# Altium schematic sheet adc_power.SchDoc
size A4; Author: Omri Nissan; Organization: Altium Limited; Address1: -; Address2: San Luis Obispo; Address3: California, 93401; Address4: United States; DocumentNumber: 10; SheetNumber: 10; SheetTotal: 10
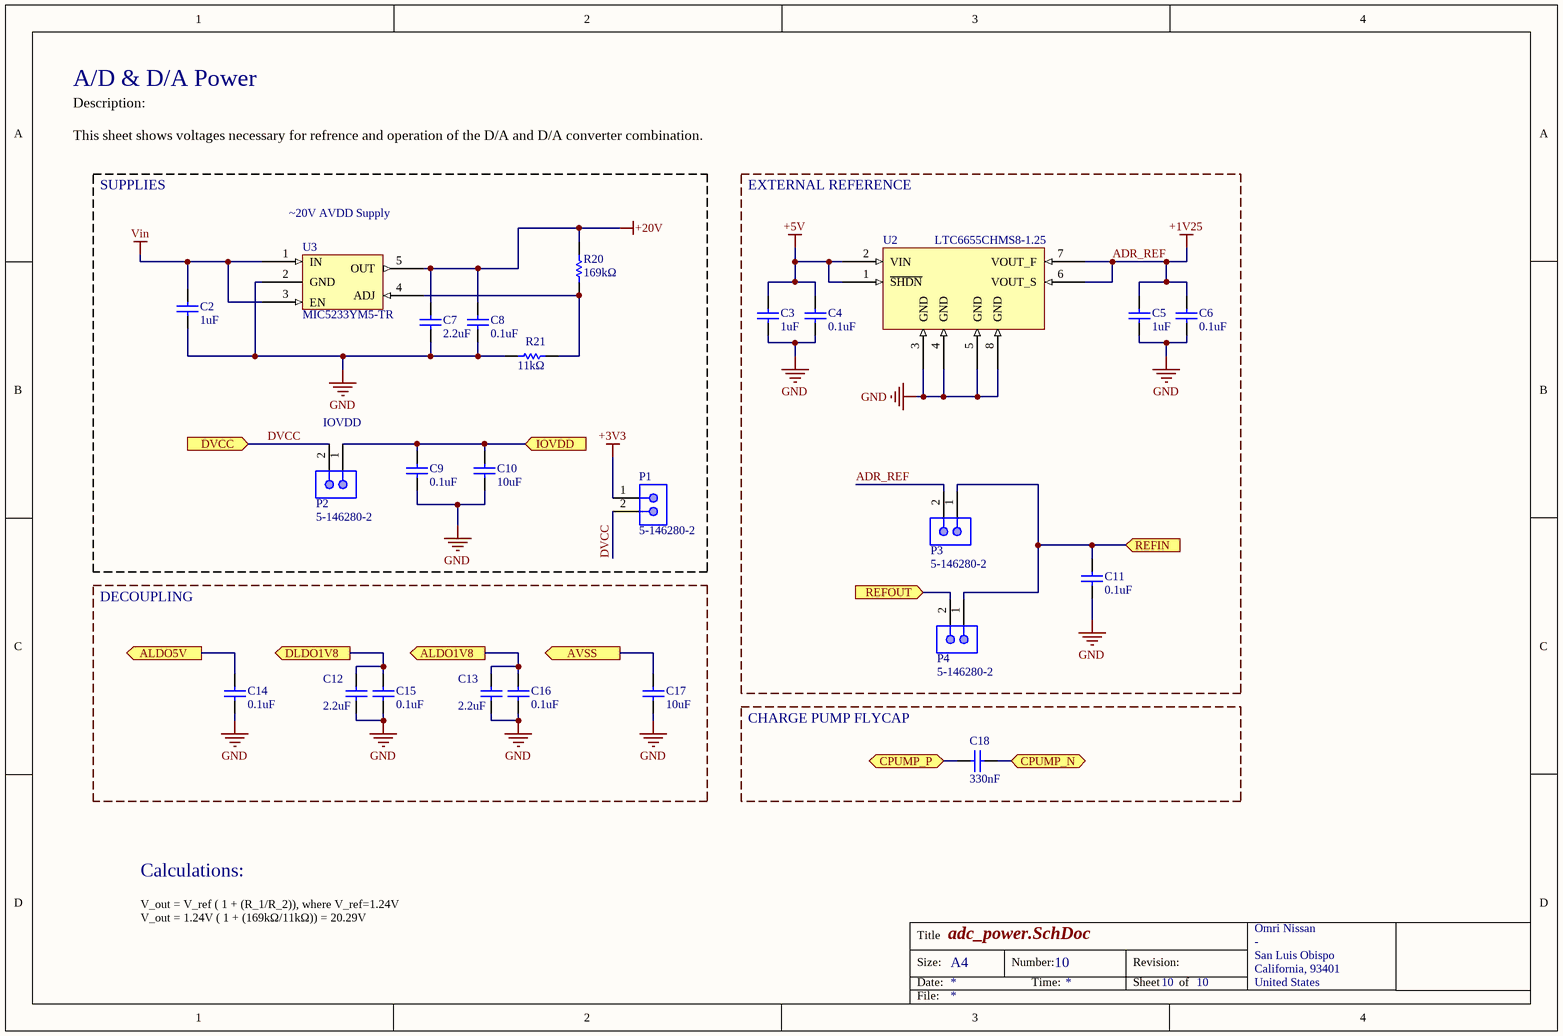
[diagram p0: adc_power.SchDoc]

## Parts
C2  1uF  [CAPC1608X90X20LL10]
C3  1uF  [CAPC1608X90X20LL10]
C4  0.1uF  [CAPC1608X90X35ML10T15]
C5  1uF  [CAPC1608X90X20LL10]
C6  0.1uF  [CAPC1608X90X35ML10T15]
C7  2.2uF  [CAPC2013X145X20LL20]
C8  0.1uF  [CAPC1608X90X35ML10T15]
C9  0.1uF  [CAPC1608X90X35ML10T15]
C10  10uF  [CAPC3216X180X20LL20]
C11  0.1uF  [CAPC1608X90X35ML10T15]
C12  2.2uF  [CAPC2013X145X20LL20]
C13  2.2uF  [CAPC2013X145X20LL20]
C14  0.1uF  [CAPC1608X90X35ML10T15]
C15  0.1uF  [CAPC1608X90X35ML10T15]
C16  0.1uF  [CAPC1608X90X35ML10T15]
C17  10uF  [CAPC3216X180X20LL20]
C18  330nF  [CAPC1608X90X35NL10T15]
P1  5-146280-2  [TECO-5-146280-2_V]
P2  5-146280-2  [TECO-5-146280-2_V]
P3  5-146280-2  [TECO-5-146280-2_V]
P4  5-146280-2  [TECO-5-146280-2_V]
R20  169kΩ  [RESC1608X55X30ML15T15]
R21  11kΩ  [RESC1609X50X30ML10T20]
U2  LTC6655CHMS8-1.25  [ADI-RM-8_L]
U3  MIC5233YM5-TR  [MF05A_L]

## Blocks framed on the sheet
SUPPLIES: C2 C7-C10 P1 P2 R20 R21 U3
EXTERNAL REFERENCE: C3-C6 C11 P3 P4 U2
DECOUPLING: C12-C17
CHARGE PUMP FLYCAP: C18

## Ports
ALDO1V8 (out), ALDO5V (out), AVSS (out), CPUMP_N (bidir), CPUMP_P (bidir), DLDO1V8 (out), DVCC (in), IOVDD (in), REFIN (in), REFOUT (in)

## Nets
+3V3: P1.1
+5V: C3.1 C4.2 U2.1(~{SHDN}) U2.2(VIN)
+20V: C7.2 C8.2 R20.2 U3.5(OUT)
ADR_REF: C5.1 C6.2 P3.2 U2.6(VOUT_S) U2.7(VOUT_F)  [also labelled +1V25]
GND: C2.2 C3.2 C4.1 C5.2 C6.1 C7.1 C8.1 C9.1 C10.1 C11.1 C12.1 C13.1 C14.1 C15.1 C16.1 C17.1 R21.1 U2.3(GND) U2.4(GND) U2.5(GND) U2.8(GND) U3.2(GND)
Vin: C2.1 U3.1(IN) U3.3(EN)
ALDO1V8: C13.2 C16.2 ; port ALDO1V8
ALDO5V: C14.2 ; port ALDO5V
AVSS: C17.2 ; port AVSS
CPUMP_N: C18.2 ; port CPUMP_N
CPUMP_P: C18.1 ; port CPUMP_P
DLDO1V8: C12.2 C15.2 ; port DLDO1V8
DVCC: P1.2 P2.2 ; port DVCC
IOVDD: C9.2 C10.2 P2.1 ; port IOVDD
REFIN: C11.2 P3.1 P4.1 ; port REFIN
REFOUT: P4.2 ; port REFOUT
NetR20_1: R20.1 R21.2 U3.4(ADJ)

## Notes on the sheet
- A/D & D/A Power
- Description:
  This sheet shows voltages necessary for refrence and operation of the D/A and D/A converter combination.
- (near U3) ~20V AVDD Supply
- (near P2) IOVDD
- Calculations:
- V_out = V_ref ( 1 + (R_1/R_2)), where V_ref=1.24V
  V_out = 1.24V ( 1 + (169kΩ/11kΩ)) = 20.29V
- Title
- Size:
- Date:
- A4
- Number:
- Time:
- Revision:
- Sheet
- of
- File:

## Library data of the parts
C2 C3 C5 = CMP-2000-06025-1: C1608X5R1H105K080AB- Chip Capacitor, 1 uF, +/- 10%, 50 V, -55 to 85 degC, 0603 (1608 Metric), RoHS, Tape and Reel; Manufacturer: TDK; PCN Part Number: MLCCPartNumberChange30/Nov/2012; Other Names: 445-7468-6; Online Catalog: CSeries,GeneralPurpose; Capacitance: 1µF; Product Training Modules: CSeriesGeneralApplicationsSEAT,CCV,andTVCLDesignToolsGuidetoReplacinganElectrolyticCapacitorwithanMLCC; Voltage - Rated: 50V; Design Resources: 20WNon-IsolatedBuckLEDDriverUsingPLLNK460KG; Temperature Coefficient: X5R; Series: C; Datasheet Version: 08/2016; Package Description: 2-Pin Surface Mount Device, Body 1.6 x 0.8 mm; Mounting Technology: SurfaceMount; Features: -; Size / Dimension: 0.063"Lx0.031"W(1.60mmx0.80mm); Lead Spacing: -; Operating Temperature: -55°C~85°C; Tolerance: ±10%; Height - Seated (Max): -; Mounting Type: SurfaceMount,MLCC; Ratings: -; Standard Package: 1; Applications: GeneralPurpose; Datasheet URL: https://product.tdk.com/info/en/catalog/datasheets/mlcc_commercial_general_en.pdf; Category: Capacitors; Lead Style: -; Packaging: Digi-Reel®; RoHS Information: RoHSCertificate-MLCC; Package / Case: 0603(1608Metric); Package Reference: 0603; Manufacturer URL: http://www.tdk.com/; Thickness (Max): 0.035"(0.90mm); Family: CeramicCapacitors
C4 C6 C8 C9 C11 C14-C16 = CMP-2100-03643-1: GRM188R71H104KA93D - Chip Capacitor, 0.1 uF, +/- 10%, 50 V, -55 to 125 degC, 0603 (1608 Metric), RoHS, Tape and Reel; Manufacturer: Murata; Dielectric Material: Ceramic; Voltage Rating: 50V; Capacitance: 100nF; Dielectric: X7R; Insulation Resistance: 10GR; Case Code (Metric): 1608; Lead Free: LeadFree; Depth: 0.8mm; Number of Pins: 2; Radiation Hardening: No; Case/Package: 0603; Manufacturer URL: http://www.murata.com/; Packaging: TapeandReel; Length: 1.6mm; Contact Plating: Tin; Datasheet URL: http://psearch.en.murata.com/capacitor/product/GRM188R71H104KA93%23.pdf; Tolerance: 10%; Case Code (Imperial): 0603; Min Operating Temperature: -55degC; RoHSCompliant: true; Voltage: 50V; Termination: SMD/SMT; Mount: SurfaceMount; Material: Ceramic; Package Quantity: 1; Height: 0.8mm; Thickness: 0.035inch; REACH SVHC: NoSVHC; Max Operating Temperature: 125degC; Width: 0.8mm; Package Reference: 0603; Voltage Rating (DC): 50V; Datasheet Version: 42675.0; Package Description: 2-Pin Surface Mount Device, Body 1.6 x 0.8 mm
C7 C12 C13 = CMP-2000-06040-1: C2012X7R1H225K125AC -Chip Capacitor, 2.2 uF, +/- 10%, 50 V, -55 to 125 degC, 0805 (2012 Metric), RoHS, Tape and Reel; Manufacturer: TDK; PCN Part Number: MLCCPartNumberChange30/Nov/2012; Other Names: 445-5968-1; Temperature Coefficient: X7R; Catalog Drawings: CSERIES_2012-0805_1.45; Kits: 445-9015-KIT-ND-KITMLCC1000PF-47UF080510-50V445-9003-KIT-ND-KITCAPCERHICAPMLCCSMD445-173086-KIT-ND-C0402-2220X7R6.3-50V1,000PF-; Online Catalog: CSeries,GeneralPurpose; Voltage - Rated: 50V; Capacitance: 2.2µF; Product Training Modules: CSeriesGeneralApplicationsSEAT,CCV,andTVCLDesignToolsGuidetoReplacinganElectrolyticCapacitorwithanMLCC; Operating Temperature: -55°C~125°C; Features: -; Tolerance: ±10%; Datasheet URL: https://datasheet.ciiva.com/24216/c2012x7r1h225k125ac-265016-24216364.pdf; Lead Style: -; Size / Dimension: 0.079"Lx0.049"W(2.00mmx1.25mm); Mounting Technology: SurfaceMount; Package Reference: 0805; Thickness (Max): 0.057"(1.45mm); RoHS Information: RoHSCertificate-MLCC; Height - Seated (Max): -; Manufacturer URL: http://www.tdk.com/; Standard Package: 1; Category: Capacitors; Package Description: 2-Pin Surface Mount Device, Body 2 x 1.25 mm; Packaging: CutTape(CT); Series: C; Applications: GeneralPurpose; Package / Case: 0805(2012Metric); Ratings: -; Datasheet Version: 09/2013; Family: CeramicCapacitors; Mounting Type: SurfaceMount,MLCC; Lead Spacing: -
C10 C17 = CMP-2000-06045-1: C3216X5R1H106K160AB - Chip Capacitor, 10 uF, +/- 10%, 50 V, -55 to 85 degC, 1206 (3216 Metric), RoHS, Tape and Reel; Manufacturer: TDK; PCN Part Number: MLCCPartNumberChange30/Nov/2012; Temperature Coefficient: X5R; Catalog Drawings: CSERIES_1206_1.8; Capacitance: 10µF; Product Training Modules: CSeriesGeneralApplicationsSEAT,CCV,andTVCLDesignToolsGuidetoReplacinganElectrolyticCapacitorwithanMLCC; Voltage - Rated: 50V; Other Names: 445-5998-6; Online Catalog: CSeries,GeneralPurpose; Family: CeramicCapacitors; Package URL: https://product.tdk.com/info/en/documents/chara_sheet/C3216X7R1V106K160AC.pdf; Height - Seated (Max): -; RoHS Information: RoHSCertificate-MLCC; Ratings: -; Series: C; Applications: GeneralPurpose; Thickness (Max): 0.071"(1.80mm); Manufacturer URL: http://www.tdk.com/; Standard Package: 1; Operating Temperature: -55°C~85°C; Tolerance: ±10%; Datasheet URL: https://product.tdk.com/info/en/catalog/datasheets/mlcc_commercial_general_en.pdf; Package / Case: 1206(3216Metric); Package Description: 2-Pin Surface Mount Device, Body 3.2 x 1.6 mm; Size / Dimension: 0.126"Lx0.063"W(3.20mmx1.60mm); Mounting Technology: SurfaceMount; Packaging: Digi-Reel®; Category: Capacitors; Package Reference: 1206; Mounting Type: SurfaceMount,MLCC; Datasheet Version: 08/2016; Lead Style: -; Features: -; Lead Spacing: -
C18 = CMP-2006-02838-1: GRM188R71A334KA61D; Manufacturer: Murata; Part Number: GRM188R71A334KA61D
P1-P4 = CMP-2000-07492-1: Male Header, Pitch 2.54 mm, 1 x 2 Position, Height 8.21 mm, Tail Length 3.05 mm, -65 to 105 degC, RoHS, Bulk; Manufacturer: TE Connectivity; Mating Connector Lock: No(Without); Number of Positions: 2; Pitch: 2.54mm; PCB Mounting Orientation: Vertical; Keyed: No; Case\/Package: 100; Mating Post Length: 0.23inch; High Temperature Housing: Yes; Max Current Rating: 5A; PCB Thickness: 0.063inch; PCB Mount Retention: Without; Approvals: CSA; Current Rating: 3A; Radiation Hardening: No; Length: 4.67mm; Contact Mating Length: 0.23inch; Connector Type: Header; Number of Rows: 1; Termination Post Length: 0.12inch; Board Standoff: No(Without); Max Operating Temperature: 105degC; Contact Shape: Square; Selectively Loaded: No(Without); Gasket: No(Without); Number of Contacts: 2; Contact Gender: Male; Mating Alignment: No(Without); Manufacturer URL: http://www.te.com/; Datasheet URL: http://www.te.com/commerce/DocumentDelivery/DDEController?Action=showdoc&DocId=Customer+Drawing%7F146280%7FH1%7Fpdf%7FEnglish%7FENG_CD_146280_H1.pdf%7F5-146280-2; Mount: ThroughHole; Orientation: Straight; Packaging: Carton; Package Reference: 5-146280-2; Package Quantity: 500; Stabilizers: No(Without); Row Spacing: 2.54mm; Contact Material: CopperAlloy; Panel Mount Retention: No(Without); Datasheet Version: Rev. H1, 08/2016; Housing Colour: Black; Colour: Black; Package Description: Male Header, Pitch 2.54 mm, 1 x 2 Position, Height 8.21 mm, Tail Length 3.05 mm; Contact Plating: Matte; Housing Material: Polymer; Contact Protection: No(Without); Min Operating Temperature: -65degC; Mounting Technology: ThroughHole; Flammability Rating: UL94V-0; RoHSCompliant: true; Termination: ThroughHole; Depth: 2.34mm; High Speed Serial Data Connector: No
R20 = CMP-2000-00284-1: ERJ-3EKF1693V; Manufacturer: Panasonic; Part Number: ERJ-3EKF1693V
R21 = CMP-2000-03860-1: CRCW060311K0FKEA; Manufacturer: Vishay Dale; Part Number: CRCW060311K0FKEA
U2 = LTC6655CHMS8-1.25#PBF: IC VREF SERIES 1.25V 8MSOP; Manufacturer 1: Analog Devices / Linear Technology; Tolerance: 0.05%; Number of Channels: 1; Temperature Coefficient: 5ppm/°C; Quiescent Current: 7mA; Output Current: 5mA; Supplier 1: Digi-Key; Manufacturer Part Number 1: LTC6655CHMS8-1.25#PBF; Stock 1: 452; Pricing 1: 1=7.80000, 25=5.18120, 100=4.28400 (USD); RoHS: Yes; Mount: Surface Mount; Case/Package: MSOP; Number of Pins: 8; Min Operating Temperature: -40°C; Max Operating Temperature: 125°C; Package Quantity: 50; Packaging: Rail/Tube; Output Voltage: 1.25V; Max Output Voltage: 1.25V; Reference Type: Series; Nominal Supply Current: 5mA; ComponentLink1URL: https://datasheet.ciiva.com/2006/28576-2006051.pdf?src-supplier=Digi-Key; ComponentLink1Description: https://datasheet.ciiva.com/2006/28576-2006051.pdf?src-supplier=Digi-Key; ComponentLink2URL: https://datasheet.ciiva.com/14152/ltc6655-eng-ds-14152023.pdf?src-supplier=Distrelec; ComponentLink2Description: https://datasheet.ciiva.com/14152/ltc6655-eng-ds-14152023.pdf?src-supplier=Distrelec; Supplier Part Number 1: LTC6655CHMS8-1.25#PBF-ND
U3 = MIC5233YM5-TR_1: IC REG LDO ADJ .1A SOT23-5; Manufacturer 1: Microchip Micrel; Max Input Voltage: 36V; Min Input Voltage: 2.3V; Output Voltage: 20V; Output Type: Adjustable; Dropout Voltage: 270mV; Max Output Current: 100mA; Number of Outputs: 1; Min Output Voltage: 1.24V; Polarity: Positive; Output Voltage Accuracy: 1%; Supplier 1: Digi-Key; Manufacturer Part Number 1: MIC5233YM5-TR; Stock 1: 13352; Pricing 1: 1=1.20000, 25=1.00000, 100=0.91000 (USD); RoHS: Yes; Mount: Surface Mount; Case/Package: SOT-23; Number of Pins: 5; Min Operating Temperature: -40°C; Max Operating Temperature: 125°C; Packaging: Tape and Reel; Output Current: 100mA; Number of Regulators: 1; Max Output Voltage: 20V; Package Quantity: 1; Radiation Hardening: No; REACH SVHC: No SVHC; ComponentLink1URL: https://datasheet.ciiva.com/2044/mic5233-2044736.pdf?src-supplier=Digi-Key; ComponentLink1Description: https://datasheet.ciiva.com/2044/mic5233-2044736.pdf?src-supplier=Digi-Key; ComponentLink2URL: https://datasheet.ciiva.com/16374/mic5233-16374581.pdf?src-supplier=Future+Electronics; ComponentLink2Description: https://datasheet.ciiva.com/16374/mic5233-16374581.pdf?src-supplier=Future+Electronics; ComponentLink3URL: https://datasheet.ciiva.com/23773/1670787-23773077.pdf?src-supplier=Newark; ComponentLink3Description: https://datasheet.ciiva.com/23773/1670787-23773077.pdf?src-supplier=Newark; ComponentLink4URL: https://datasheet.ciiva.com/13026/mic5233-13026150.pdf?src-supplier=Mouser; ComponentLink4Description: https://datasheet.ciiva.com/13026/mic5233-13026150.pdf?src-supplier=Mouser; ComponentLink5URL: https://datasheet.ciiva.com/26890/getdatasheetpartid-111208-26890058.pdf?src-supplier=Verical; ComponentLink5Description: https://datasheet.ciiva.com/26890/getdatasheetpartid-111208-26890058.pdf?src-supplier=Verical; ComponentLink6URL: https://datasheet.ciiva.com/2044/mic5233-2044734.pdf?src-supplier=Digi-Key; ComponentLink6Description: https://datasheet.ciiva.com/2044/mic5233-2044734.pdf?src-supplier=Digi-Key; ComponentLink7URL: https://datasheet.ciiva.com/7993/1670787-7993422.pdf?src-supplier=Element14; ComponentLink7Description: https://datasheet.ciiva.com/7993/1670787-7993422.pdf?src-supplier=Element14; ComponentLink8URL: https://datasheet.ciiva.com/2044/mic5233-2044735.pdf?src-supplier=Digi-Key; ComponentLink8Description: https://datasheet.ciiva.com/2044/mic5233-2044735.pdf?src-supplier=Digi-Key; ComponentLink9URL: https://datasheet.ciiva.com/23772/1670787-23772959.pdf?src-supplier=Newark; ComponentLink9Description: https://datasheet.ciiva.com/23772/1670787-23772959.pdf?src-supplier=Newark; Supplier Part Number 1: 576-1507-1-ND